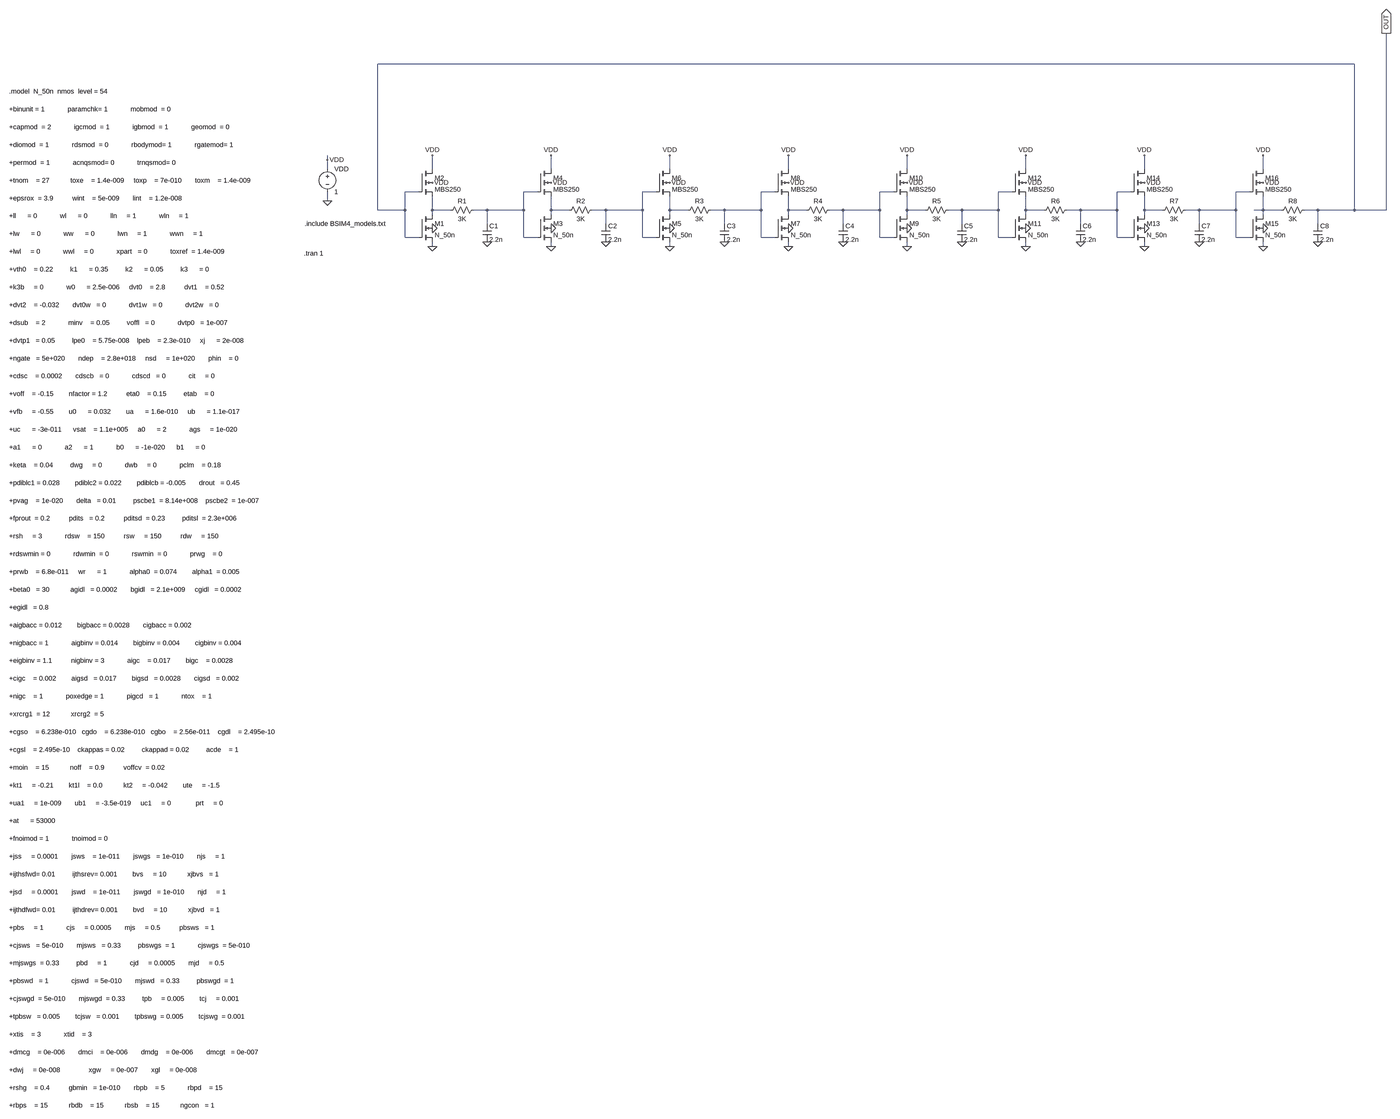
[diagram p0: schematic CMOS_ring.asc, whole sheet]
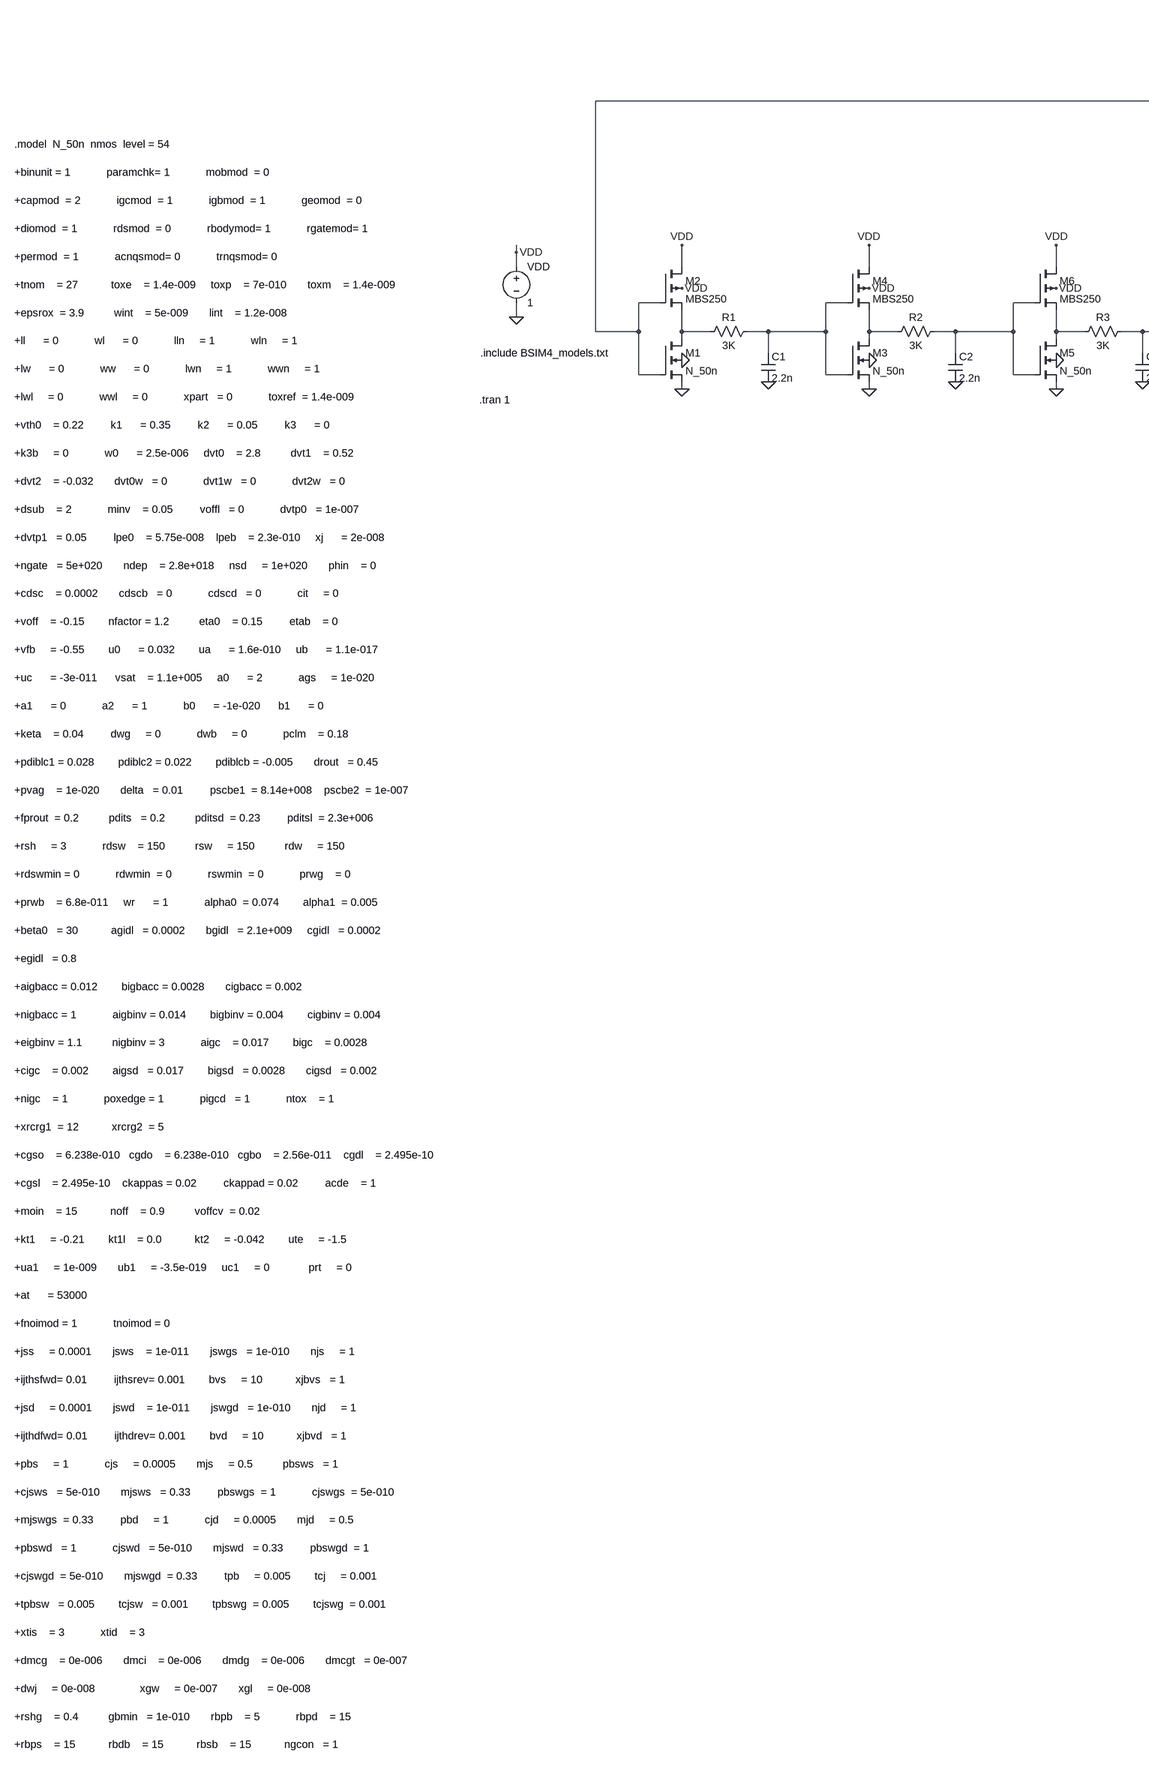
[diagram p1: schematic CMOS_ring.asc, part, row 1 of 1, column 1 of 2]
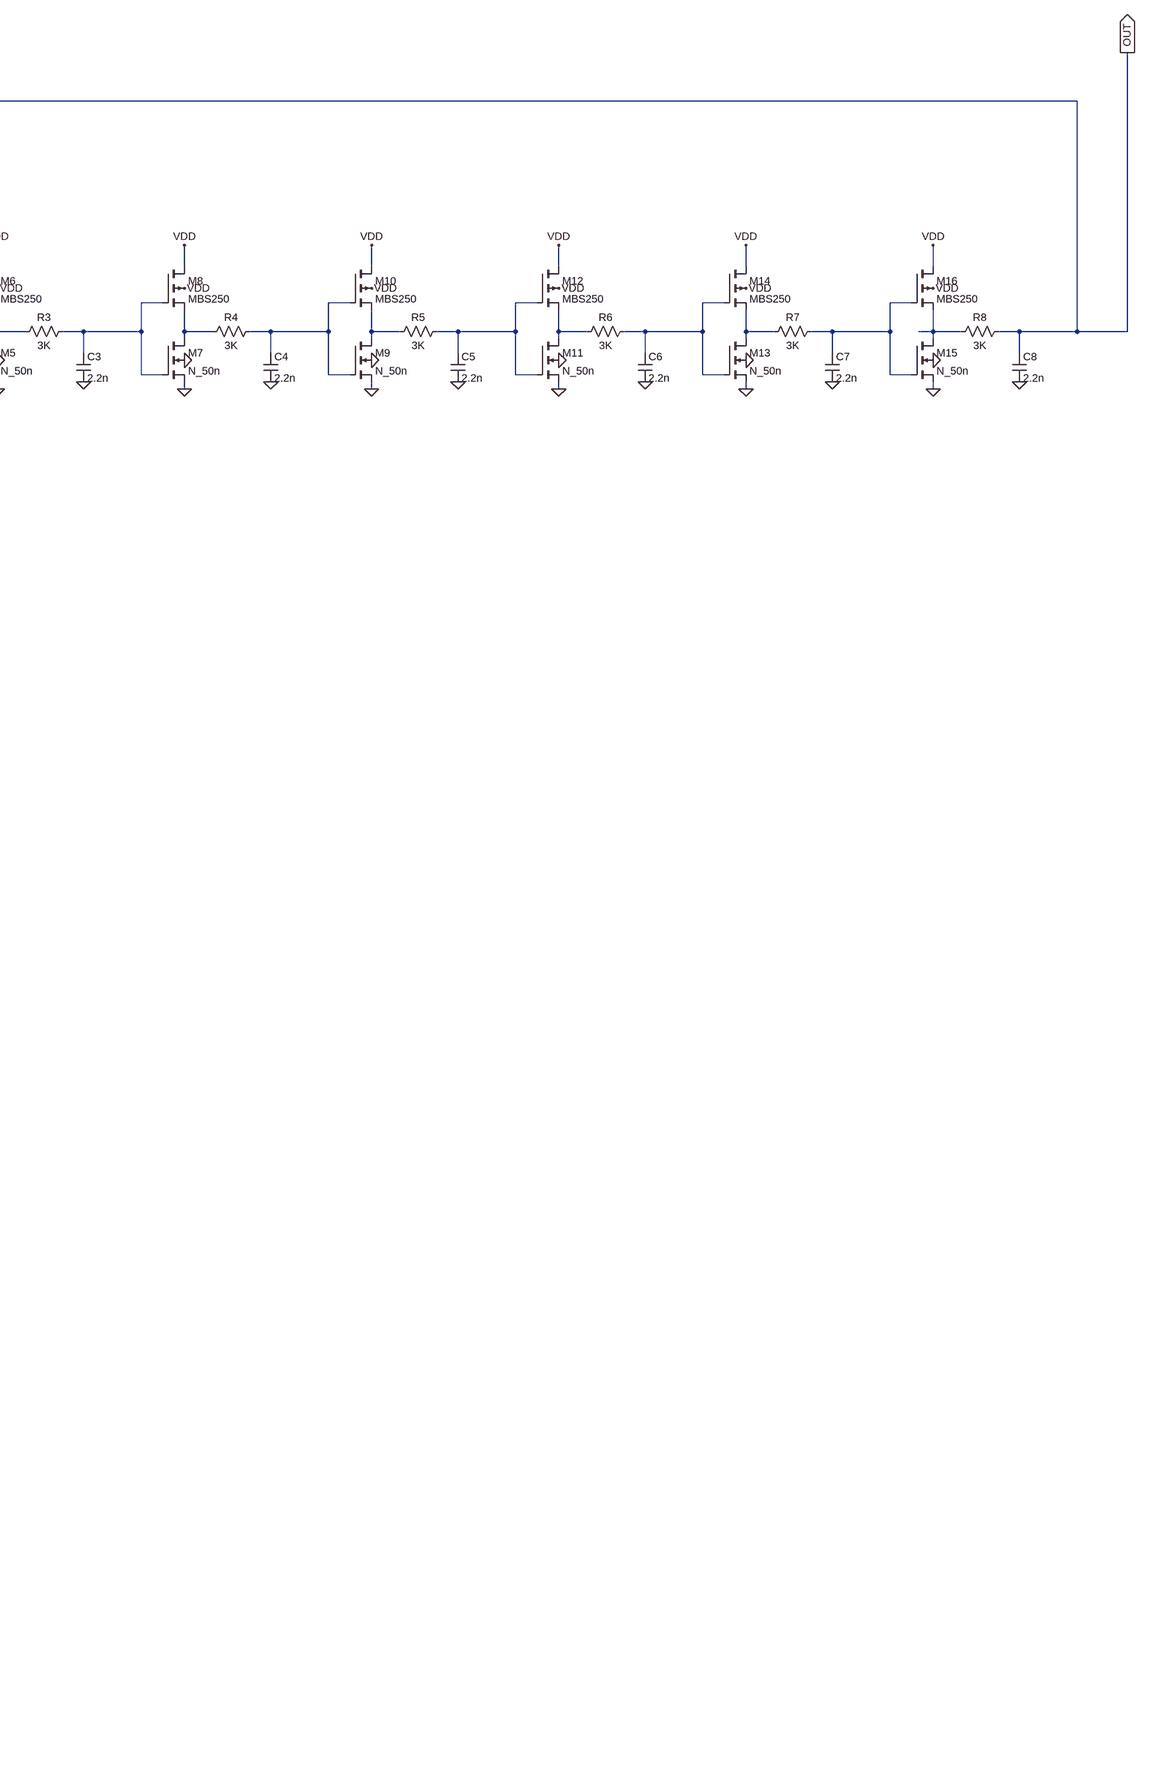
[diagram p2: schematic CMOS_ring.asc, part, row 1 of 1, column 2 of 2]
CMOS_ring.asc, the LTspice schematic file:
Version 4
SHEET 1 3700 2840
WIRE 3504 -464 80 -464
WIRE -96 -128 -96 -144
WIRE -96 -96 -96 -128
WIRE 272 -96 272 -144
WIRE 688 -96 688 -144
WIRE 1104 -96 1104 -144
WIRE 1520 -96 1520 -144
WIRE 1936 -96 1936 -144
WIRE 2352 -96 2352 -144
WIRE 2768 -96 2768 -144
WIRE 3184 -96 3184 -144
WIRE 224 -16 176 -16
WIRE 640 -16 592 -16
WIRE 1056 -16 1008 -16
WIRE 1472 -16 1424 -16
WIRE 1888 -16 1840 -16
WIRE 2304 -16 2256 -16
WIRE 2720 -16 2672 -16
WIRE 3136 -16 3088 -16
WIRE -96 16 -96 -16
WIRE 80 48 80 -464
WIRE 176 48 176 -16
WIRE 176 48 80 48
WIRE 272 48 272 0
WIRE 336 48 272 48
WIRE 464 48 416 48
WIRE 592 48 592 -16
WIRE 592 48 464 48
WIRE 688 48 688 0
WIRE 752 48 688 48
WIRE 880 48 832 48
WIRE 1008 48 1008 -16
WIRE 1008 48 880 48
WIRE 1104 48 1104 0
WIRE 1168 48 1104 48
WIRE 1296 48 1248 48
WIRE 1424 48 1424 -16
WIRE 1424 48 1296 48
WIRE 1520 48 1520 0
WIRE 1584 48 1520 48
WIRE 1712 48 1664 48
WIRE 1840 48 1840 -16
WIRE 1840 48 1712 48
WIRE 1936 48 1936 0
WIRE 2000 48 1936 48
WIRE 2128 48 2080 48
WIRE 2256 48 2256 -16
WIRE 2256 48 2128 48
WIRE 2352 48 2352 0
WIRE 2416 48 2352 48
WIRE 2544 48 2496 48
WIRE 2672 48 2672 -16
WIRE 2672 48 2544 48
WIRE 2768 48 2768 0
WIRE 2832 48 2768 48
WIRE 2960 48 2912 48
WIRE 3088 48 3088 -16
WIRE 3088 48 2960 48
WIRE 3184 48 3184 0
WIRE 3184 48 3152 48
WIRE 3248 48 3184 48
WIRE 3376 48 3328 48
WIRE 3504 48 3504 -464
WIRE 3504 48 3376 48
WIRE 3616 48 3616 -640
WIRE 3616 48 3504 48
WIRE 272 64 272 48
WIRE 688 64 688 48
WIRE 1104 64 1104 48
WIRE 1520 64 1520 48
WIRE 1936 64 1936 48
WIRE 2352 64 2352 48
WIRE 2768 64 2768 48
WIRE 3184 64 3184 48
WIRE 464 96 464 48
WIRE 880 96 880 48
WIRE 1296 96 1296 48
WIRE 1712 96 1712 48
WIRE 2128 96 2128 48
WIRE 2544 96 2544 48
WIRE 2960 96 2960 48
WIRE 3376 96 3376 48
WIRE 176 144 176 48
WIRE 224 144 176 144
WIRE 592 144 592 48
WIRE 640 144 592 144
WIRE 1008 144 1008 48
WIRE 1056 144 1008 144
WIRE 1424 144 1424 48
WIRE 1472 144 1424 144
WIRE 1840 144 1840 48
WIRE 1888 144 1840 144
WIRE 2256 144 2256 48
WIRE 2304 144 2256 144
WIRE 2672 144 2672 48
WIRE 2720 144 2672 144
WIRE 3088 144 3088 48
WIRE 3136 144 3088 144
WIRE 272 176 272 160
WIRE 688 176 688 160
WIRE 1104 176 1104 160
WIRE 1520 176 1520 160
WIRE 1936 176 1936 160
WIRE 2352 176 2352 160
WIRE 2768 176 2768 160
WIRE 3184 176 3184 160
FLAG -96 16 0
FLAG 272 176 0
FLAG -96 -128 VDD
FLAG 272 -48 VDD
FLAG 272 112 0
FLAG 272 -144 VDD
FLAG 464 160 0
FLAG 688 176 0
FLAG 688 -48 VDD
FLAG 688 112 0
FLAG 688 -144 VDD
FLAG 880 160 0
FLAG 1104 176 0
FLAG 1104 -48 VDD
FLAG 1104 112 0
FLAG 1104 -144 VDD
FLAG 1296 160 0
FLAG 1520 176 0
FLAG 1520 -48 VDD
FLAG 1520 112 0
FLAG 1520 -144 VDD
FLAG 1712 160 0
FLAG 1936 176 0
FLAG 1936 -48 VDD
FLAG 1936 112 0
FLAG 1936 -144 VDD
FLAG 2128 160 0
FLAG 2352 176 0
FLAG 2352 -48 VDD
FLAG 2352 112 0
FLAG 2352 -144 VDD
FLAG 2544 160 0
FLAG 2768 176 0
FLAG 2768 -48 VDD
FLAG 2768 112 0
FLAG 2768 -144 VDD
FLAG 2960 160 0
FLAG 3184 176 0
FLAG 3184 -48 VDD
FLAG 3184 112 0
FLAG 3184 -144 VDD
FLAG 3376 160 0
FLAG 3616 -640 OUT
IOPIN 3616 -640 Out
DATAFLAG 3616 -368 ""
DATAFLAG 3616 -368 ""
SYMBOL nmos4 224 64 R0
SYMATTR InstName M1
SYMATTR Value N_50n
SYMBOL pmos4 224 -96 R0
SYMATTR InstName M2
SYMATTR Value MBS250
SYMBOL voltage -96 -112 R0
WINDOW 123 0 0 Left 0
WINDOW 39 0 0 Left 0
SYMATTR InstName VDD
SYMATTR Value 1
SYMBOL res 432 32 R90
WINDOW 0 0 56 VBottom 2
WINDOW 3 32 56 VTop 2
SYMATTR InstName R1
SYMATTR Value 3K
SYMBOL cap 448 96 R0
SYMATTR InstName C1
SYMATTR Value 2.2n
SYMBOL nmos4 640 64 R0
SYMATTR InstName M3
SYMATTR Value N_50n
SYMBOL pmos4 640 -96 R0
SYMATTR InstName M4
SYMATTR Value MBS250
SYMBOL res 848 32 R90
WINDOW 0 0 56 VBottom 2
WINDOW 3 32 56 VTop 2
SYMATTR InstName R2
SYMATTR Value 3K
SYMBOL cap 864 96 R0
SYMATTR InstName C2
SYMATTR Value 2.2n
SYMBOL nmos4 1056 64 R0
SYMATTR InstName M5
SYMATTR Value N_50n
SYMBOL pmos4 1056 -96 R0
SYMATTR InstName M6
SYMATTR Value MBS250
SYMBOL res 1264 32 R90
WINDOW 0 0 56 VBottom 2
WINDOW 3 32 56 VTop 2
SYMATTR InstName R3
SYMATTR Value 3K
SYMBOL cap 1280 96 R0
SYMATTR InstName C3
SYMATTR Value 2.2n
SYMBOL nmos4 1472 64 R0
SYMATTR InstName M7
SYMATTR Value N_50n
SYMBOL pmos4 1472 -96 R0
SYMATTR InstName M8
SYMATTR Value MBS250
SYMBOL res 1680 32 R90
WINDOW 0 0 56 VBottom 2
WINDOW 3 32 56 VTop 2
SYMATTR InstName R4
SYMATTR Value 3K
SYMBOL cap 1696 96 R0
SYMATTR InstName C4
SYMATTR Value 2.2n
SYMBOL nmos4 1888 64 R0
SYMATTR InstName M9
SYMATTR Value N_50n
SYMBOL pmos4 1888 -96 R0
SYMATTR InstName M10
SYMATTR Value MBS250
SYMBOL res 2096 32 R90
WINDOW 0 0 56 VBottom 2
WINDOW 3 32 56 VTop 2
SYMATTR InstName R5
SYMATTR Value 3K
SYMBOL cap 2112 96 R0
SYMATTR InstName C5
SYMATTR Value 2.2n
SYMBOL nmos4 2304 64 R0
SYMATTR InstName M11
SYMATTR Value N_50n
SYMBOL pmos4 2304 -96 R0
SYMATTR InstName M12
SYMATTR Value MBS250
SYMBOL res 2512 32 R90
WINDOW 0 0 56 VBottom 2
WINDOW 3 32 56 VTop 2
SYMATTR InstName R6
SYMATTR Value 3K
SYMBOL cap 2528 96 R0
SYMATTR InstName C6
SYMATTR Value 2.2n
SYMBOL nmos4 2720 64 R0
SYMATTR InstName M13
SYMATTR Value N_50n
SYMBOL pmos4 2720 -96 R0
SYMATTR InstName M14
SYMATTR Value MBS250
SYMBOL res 2928 32 R90
WINDOW 0 0 56 VBottom 2
WINDOW 3 32 56 VTop 2
SYMATTR InstName R7
SYMATTR Value 3K
SYMBOL cap 2944 96 R0
SYMATTR InstName C7
SYMATTR Value 2.2n
SYMBOL nmos4 3136 64 R0
SYMATTR InstName M15
SYMATTR Value N_50n
SYMBOL pmos4 3136 -96 R0
SYMATTR InstName M16
SYMATTR Value MBS250
SYMBOL res 3344 32 R90
WINDOW 0 0 56 VBottom 2
WINDOW 3 32 56 VTop 2
SYMATTR InstName R8
SYMATTR Value 3K
SYMBOL cap 3360 96 R0
SYMATTR InstName C8
SYMATTR Value 2.2n
TEXT -176 96 Left 2 !.include BSIM4_models.txt
TEXT -178 200 Left 2 !.tran 1
TEXT -1360 -368 Left 2 !.model  N_50n  nmos  level = 54\n \n+binunit = 1            paramchk= 1            mobmod  = 0          \n \n+capmod  = 2            igcmod  = 1            igbmod  = 1            geomod  = 0          \n \n+diomod  = 1            rdsmod  = 0            rbodymod= 1            rgatemod= 1          \n \n+permod  = 1            acnqsmod= 0            trnqsmod= 0          \n \n+tnom    = 27           toxe    = 1.4e-009     toxp    = 7e-010       toxm    = 1.4e-009   \n \n+epsrox  = 3.9          wint    = 5e-009       lint    = 1.2e-008   \n \n+ll      = 0            wl      = 0            lln     = 1            wln     = 1          \n \n+lw      = 0            ww      = 0            lwn     = 1            wwn     = 1          \n \n+lwl     = 0            wwl     = 0            xpart   = 0            toxref  = 1.4e-009   \n \n+vth0    = 0.22         k1      = 0.35         k2      = 0.05         k3      = 0          \n \n+k3b     = 0            w0      = 2.5e-006     dvt0    = 2.8          dvt1    = 0.52       \n \n+dvt2    = -0.032       dvt0w   = 0            dvt1w   = 0            dvt2w   = 0          \n \n+dsub    = 2            minv    = 0.05         voffl   = 0            dvtp0   = 1e-007     \n \n+dvtp1   = 0.05         lpe0    = 5.75e-008    lpeb    = 2.3e-010     xj      = 2e-008     \n \n+ngate   = 5e+020       ndep    = 2.8e+018     nsd     = 1e+020       phin    = 0          \n \n+cdsc    = 0.0002       cdscb   = 0            cdscd   = 0            cit     = 0          \n \n+voff    = -0.15        nfactor = 1.2          eta0    = 0.15         etab    = 0          \n \n+vfb     = -0.55        u0      = 0.032        ua      = 1.6e-010     ub      = 1.1e-017   \n \n+uc      = -3e-011      vsat    = 1.1e+005     a0      = 2            ags     = 1e-020     \n \n+a1      = 0            a2      = 1            b0      = -1e-020      b1      = 0          \n \n+keta    = 0.04         dwg     = 0            dwb     = 0            pclm    = 0.18       \n \n+pdiblc1 = 0.028        pdiblc2 = 0.022        pdiblcb = -0.005       drout   = 0.45       \n \n+pvag    = 1e-020       delta   = 0.01         pscbe1  = 8.14e+008    pscbe2  = 1e-007     \n \n+fprout  = 0.2          pdits   = 0.2          pditsd  = 0.23         pditsl  = 2.3e+006   \n \n+rsh     = 3            rdsw    = 150          rsw     = 150          rdw     = 150        \n \n+rdswmin = 0            rdwmin  = 0            rswmin  = 0            prwg    = 0          \n \n+prwb    = 6.8e-011     wr      = 1            alpha0  = 0.074        alpha1  = 0.005      \n \n+beta0   = 30           agidl   = 0.0002       bgidl   = 2.1e+009     cgidl   = 0.0002     \n \n+egidl   = 0.8          \n \n+aigbacc = 0.012        bigbacc = 0.0028       cigbacc = 0.002\n \n+nigbacc = 1            aigbinv = 0.014        bigbinv = 0.004        cigbinv = 0.004\n \n+eigbinv = 1.1          nigbinv = 3            aigc    = 0.017        bigc    = 0.0028\n \n+cigc    = 0.002        aigsd   = 0.017        bigsd   = 0.0028       cigsd   = 0.002\n \n+nigc    = 1            poxedge = 1            pigcd   = 1            ntox    = 1\n \n+xrcrg1  = 12           xrcrg2  = 5          \n \n+cgso    = 6.238e-010   cgdo    = 6.238e-010   cgbo    = 2.56e-011    cgdl    = 2.495e-10     \n \n+cgsl    = 2.495e-10    ckappas = 0.02         ckappad = 0.02         acde    = 1          \n \n+moin    = 15           noff    = 0.9          voffcv  = 0.02       \n \n+kt1     = -0.21        kt1l    = 0.0           kt2     = -0.042        ute     = -1.5\n \n+ua1     = 1e-009       ub1     = -3.5e-019     uc1     = 0             prt     = 0\n \n+at      = 53000\n \n+fnoimod = 1            tnoimod = 0          \n \n+jss     = 0.0001       jsws    = 1e-011       jswgs   = 1e-010       njs     = 1          \n \n+ijthsfwd= 0.01         ijthsrev= 0.001        bvs     = 10           xjbvs   = 1          \n \n+jsd     = 0.0001       jswd    = 1e-011       jswgd   = 1e-010       njd     = 1          \n \n+ijthdfwd= 0.01         ijthdrev= 0.001        bvd     = 10           xjbvd   = 1          \n \n+pbs     = 1            cjs     = 0.0005       mjs     = 0.5          pbsws   = 1          \n \n+cjsws   = 5e-010       mjsws   = 0.33         pbswgs  = 1            cjswgs  = 5e-010     \n \n+mjswgs  = 0.33         pbd     = 1            cjd     = 0.0005       mjd     = 0.5        \n \n+pbswd   = 1            cjswd   = 5e-010       mjswd   = 0.33         pbswgd  = 1          \n \n+cjswgd  = 5e-010       mjswgd  = 0.33         tpb     = 0.005        tcj     = 0.001      \n \n+tpbsw   = 0.005        tcjsw   = 0.001        tpbswg  = 0.005        tcjswg  = 0.001      \n \n+xtis    = 3            xtid    = 3          \n \n+dmcg    = 0e-006       dmci    = 0e-006       dmdg    = 0e-006       dmcgt   = 0e-007     \n \n+dwj     = 0e-008               xgw     = 0e-007       xgl     = 0e-008     \n \n+rshg    = 0.4          gbmin   = 1e-010       rbpb    = 5            rbpd    = 15         \n \n+rbps    = 15           rbdb    = 15           rbsb    = 15           ngcon   = 1

The netlist it stands for:
* CMOS_ring.asc
M1 N008 OUT 0 0 N_50n
M2 VDD OUT N008 VDD MBS250
VDD VDD 0 1
R1 N001 N008 3K
C1 N001 0 2.2n
M3 N009 N001 0 0 N_50n
M4 VDD N001 N009 VDD MBS250
R2 N002 N009 3K
C2 N002 0 2.2n
M5 N010 N002 0 0 N_50n
M6 VDD N002 N010 VDD MBS250
R3 N003 N010 3K
C3 N003 0 2.2n
M7 N011 N003 0 0 N_50n
M8 VDD N003 N011 VDD MBS250
R4 N004 N011 3K
C4 N004 0 2.2n
M9 N012 N004 0 0 N_50n
M10 VDD N004 N012 VDD MBS250
R5 N005 N012 3K
C5 N005 0 2.2n
M11 N013 N005 0 0 N_50n
M12 VDD N005 N013 VDD MBS250
R6 N006 N013 3K
C6 N006 0 2.2n
M13 N014 N006 0 0 N_50n
M14 VDD N006 N014 VDD MBS250
R7 N007 N014 3K
C7 N007 0 2.2n
M15 N015 N007 0 0 N_50n
M16 VDD N007 N015 VDD MBS250
R8 OUT N015 3K
C8 OUT 0 2.2n
.model NMOS NMOS
.model PMOS PMOS
.lib standard.mos
.include BSIM4_models.txt
.tran 1
.model  N_50n  nmos  level = 54
+binunit = 1            paramchk= 1            mobmod  = 0
+capmod  = 2            igcmod  = 1            igbmod  = 1            geomod  = 0
+diomod  = 1            rdsmod  = 0            rbodymod= 1            rgatemod= 1
+permod  = 1            acnqsmod= 0            trnqsmod= 0
+tnom    = 27           toxe    = 1.4e-009     toxp    = 7e-010       toxm    = 1.4e-009
+epsrox  = 3.9          wint    = 5e-009       lint    = 1.2e-008
+ll      = 0            wl      = 0            lln     = 1            wln     = 1
+lw      = 0            ww      = 0            lwn     = 1            wwn     = 1
+lwl     = 0            wwl     = 0            xpart   = 0            toxref  = 1.4e-009
+vth0    = 0.22         k1      = 0.35         k2      = 0.05         k3      = 0
+k3b     = 0            w0      = 2.5e-006     dvt0    = 2.8          dvt1    = 0.52
+dvt2    = -0.032       dvt0w   = 0            dvt1w   = 0            dvt2w   = 0
+dsub    = 2            minv    = 0.05         voffl   = 0            dvtp0   = 1e-007
+dvtp1   = 0.05         lpe0    = 5.75e-008    lpeb    = 2.3e-010     xj      = 2e-008
+ngate   = 5e+020       ndep    = 2.8e+018     nsd     = 1e+020       phin    = 0
+cdsc    = 0.0002       cdscb   = 0            cdscd   = 0            cit     = 0
+voff    = -0.15        nfactor = 1.2          eta0    = 0.15         etab    = 0
+vfb     = -0.55        u0      = 0.032        ua      = 1.6e-010     ub      = 1.1e-017
+uc      = -3e-011      vsat    = 1.1e+005     a0      = 2            ags     = 1e-020
+a1      = 0            a2      = 1            b0      = -1e-020      b1      = 0
+keta    = 0.04         dwg     = 0            dwb     = 0            pclm    = 0.18
+pdiblc1 = 0.028        pdiblc2 = 0.022        pdiblcb = -0.005       drout   = 0.45
+pvag    = 1e-020       delta   = 0.01         pscbe1  = 8.14e+008    pscbe2  = 1e-007
+fprout  = 0.2          pdits   = 0.2          pditsd  = 0.23         pditsl  = 2.3e+006
+rsh     = 3            rdsw    = 150          rsw     = 150          rdw     = 150
+rdswmin = 0            rdwmin  = 0            rswmin  = 0            prwg    = 0
+prwb    = 6.8e-011     wr      = 1            alpha0  = 0.074        alpha1  = 0.005
+beta0   = 30           agidl   = 0.0002       bgidl   = 2.1e+009     cgidl   = 0.0002
+egidl   = 0.8
+aigbacc = 0.012        bigbacc = 0.0028       cigbacc = 0.002
+nigbacc = 1            aigbinv = 0.014        bigbinv = 0.004        cigbinv = 0.004
+eigbinv = 1.1          nigbinv = 3            aigc    = 0.017        bigc    = 0.0028
+cigc    = 0.002        aigsd   = 0.017        bigsd   = 0.0028       cigsd   = 0.002
+nigc    = 1            poxedge = 1            pigcd   = 1            ntox    = 1
+xrcrg1  = 12           xrcrg2  = 5
+cgso    = 6.238e-010   cgdo    = 6.238e-010   cgbo    = 2.56e-011    cgdl    = 2.495e-10
+cgsl    = 2.495e-10    ckappas = 0.02         ckappad = 0.02         acde    = 1
+moin    = 15           noff    = 0.9          voffcv  = 0.02
+kt1     = -0.21        kt1l    = 0.0           kt2     = -0.042        ute     = -1.5
+ua1     = 1e-009       ub1     = -3.5e-019     uc1     = 0             prt     = 0
+at      = 53000
+fnoimod = 1            tnoimod = 0
+jss     = 0.0001       jsws    = 1e-011       jswgs   = 1e-010       njs     = 1
+ijthsfwd= 0.01         ijthsrev= 0.001        bvs     = 10           xjbvs   = 1
+jsd     = 0.0001       jswd    = 1e-011       jswgd   = 1e-010       njd     = 1
+ijthdfwd= 0.01         ijthdrev= 0.001        bvd     = 10           xjbvd   = 1
+pbs     = 1            cjs     = 0.0005       mjs     = 0.5          pbsws   = 1
+cjsws   = 5e-010       mjsws   = 0.33         pbswgs  = 1            cjswgs  = 5e-010
+mjswgs  = 0.33         pbd     = 1            cjd     = 0.0005       mjd     = 0.5
+pbswd   = 1            cjswd   = 5e-010       mjswd   = 0.33         pbswgd  = 1
+cjswgd  = 5e-010       mjswgd  = 0.33         tpb     = 0.005        tcj     = 0.001
+tpbsw   = 0.005        tcjsw   = 0.001        tpbswg  = 0.005        tcjswg  = 0.001
+xtis    = 3            xtid    = 3
+dmcg    = 0e-006       dmci    = 0e-006       dmdg    = 0e-006       dmcgt   = 0e-007
+dwj     = 0e-008               xgw     = 0e-007       xgl     = 0e-008
+rshg    = 0.4          gbmin   = 1e-010       rbpb    = 5            rbpd    = 15
+rbps    = 15           rbdb    = 15           rbsb    = 15           ngcon   = 1
.backanno
.end